# EAGLE design tractor_panel_1v0 (EAGLE 9.5.2)
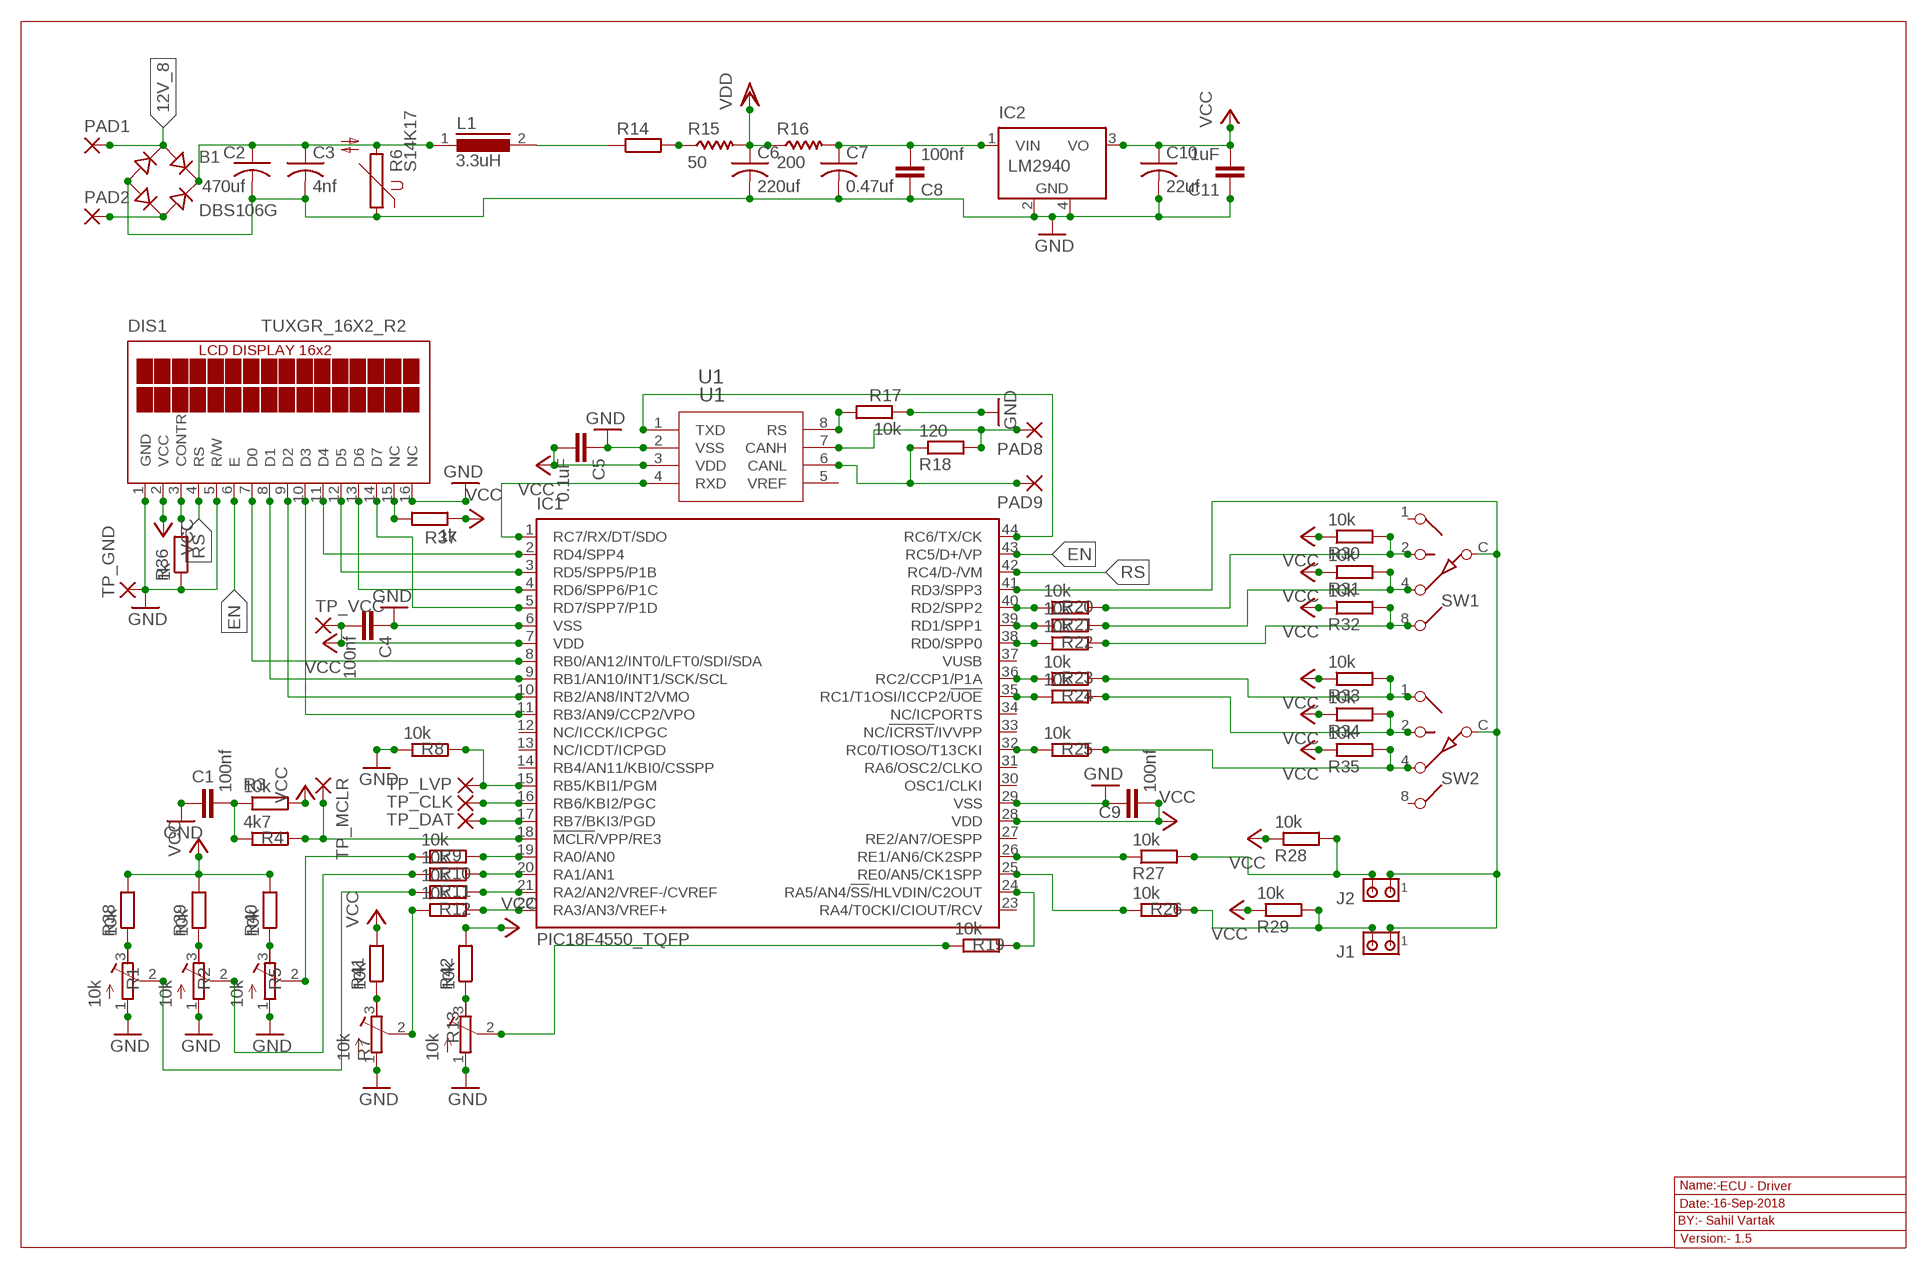
[diagram p0: schematic, sheet 1]

## Parts
B1  DBS106G  [DBS]
C1  100nf  CC0603  [C0603]
C2  470uf  C-US050-075X075  [C050-075X075]
C3  4nf  C-US050-045X075  [C050-045X075]
C4  100nf  CC0603  [C0603]
C5  0.1uF  CC0603  [C0603]
C6  220uf  C-US025-025X050  [C025-025X050]
C7  0.47uf  C-US025-025X050  [C025-025X050]
C8  100nf  CC0603  [C0603]
C9  100nf  CC0603  [C0603]
C10  22uf  C-US025-025X050  [C025-025X050]
C11  1uF  CC0603  [C0603]
DIS1  TUXGR_16X2_R2  [TUXGR_16X2_R2]
IC1  PIC18F4550_TQFP  [TQFP44]
IC2  LM2940  LM2936MP-3.0  [SOT223]
J1  MTA02-156  [1X2MTA]
J2  MTA02-156  [1X2MTA]
L1  3.3uH  82114R  [82114R]
PAD1  2,54/1,1  [2,54/1,1]
PAD2  2,54/1,1  [2,54/1,1]
PAD8  2,54/1,1  [2,54/1,1]
PAD9  2,54/1,1  [2,54/1,1]
R1  10k  R-TRIMM3296W  [RTRIM3296W]
R2  10k  R-TRIMM3296W  [RTRIM3296W]
R3  10k  RR0603  [R0603]
R4  4k7  RR0603  [R0603]
R5  10k  R-TRIMM3296W  [RTRIM3296W]
R6  S14K17  [S14K17]
R7  10k  R-TRIMM3296W  [RTRIM3296W]
R8  10k  RR0603  [R0603]
R9  10k  RR0603  [R0603]
R10  10k  RR0603  [R0603]
R11  10k  RR0603  [R0603]
R12  10k  RR0603  [R0603]
R13  10k  R-TRIMM3296W  [RTRIM3296W]
R14  R-EU_R0603  [R0603]
R15  50  R-US_WSC2515  [WSC2515]
R16  200  R-US_WSC2515  [WSC2515]
R17  10k  RR0603  [R0603]
R18  120  RR0603  [R0603]
R19  10k  RR0603  [R0603]
R20  10k  RR0603  [R0603]
R21  10k  RR0603  [R0603]
R22  10k  RR0603  [R0603]
R23  10k  RR0603  [R0603]
R24  10k  RR0603  [R0603]
R25  10k  RR0603  [R0603]
R26  10k  RR0603  [R0603]
R27  10k  RR0603  [R0603]
R28  10k  RR0603  [R0603]
R29  10k  RR0603  [R0603]
R30  10k  RR0603  [R0603]
R31  10k  RR0603  [R0603]
R32  10k  RR0603  [R0603]
R33  10k  RR0603  [R0603]
R34  10k  RR0603  [R0603]
R35  10k  RR0603  [R0603]
R36  1k  RR0603  [R0603]
R37  1k  RR0603  [R0603]
R38  10k  RR0603  [R0603]
R39  10k  RR0603  [R0603]
R40  10k  RR0603  [R0603]
R41  10k  RR0603  [R0603]
R42  10k  RR0603  [R0603]
SW1  SW-C10  [SW-C10]
SW2  SW-C10  [SW-C10]
TP_CLK  1,6/0,8  [1,6/0,8]
TP_DAT  1,6/0,8  [1,6/0,8]
TP_GND  1,6/0,8  [1,6/0,8]
TP_LVP  1,6/0,8  [1,6/0,8]
TP_MCLR  1,6/0,8  [1,6/0,8]
TP_VCC  1,6/0,8  [1,6/0,8]
U1  U1  MCP2551-I/SNSOIC8-N_MC-M  [SOIC8-N_MC-M]

## Nets
12V_8: B1.AC1 PAD1.1(P)
EN: DIS1.6(E) IC1.43(RC5/D+/VP)
GND: B1.- C1.1 C2.2 C3.2 C4.1 C5.1 C6.2 C7.2 C8.1 C9.1 C10.2 C11.1 DIS1.1(GND) DIS1.5(R/W) DIS1.16(NC) IC1.6(VSS) IC1.29(VSS) IC2.2(GND) IC2.4(GND) R1.1(A) R2.1(A) R5.1(A) R6.1 R7.1(A) R8.1 R13.1(A) R17.1 R36.1 TP_GND.1(P) U1.2(VSS)
N$1: B1.AC2 PAD2.1(P)
N$2: DIS1.7(D0) IC1.8(RB0/AN12/INT0/LFT0/SDI/SDA)
N$3: L1.2 R14.1
N$4: DIS1.8(D1) IC1.9(RB1/AN10/INT1/SCK/SCL)
N$5: R13.2(S) R19.1
N$6: DIS1.9(D2) IC1.10(RB2/AN8/INT2/VMO)
N$7: C7.1 C8.2 IC2.1(VIN) R16.2
N$8: DIS1.3(CONTR) R36.2
N$9: DIS1.15(NC) R37.2
N$10: DIS1.10(D3) IC1.11(RB3/AN9/CCP2/VPO)
N$11: DIS1.11(D4) IC1.2(RD4/SPP4)
N$12: DIS1.14(D7) IC1.5(RD7/SPP7/P1D)
N$13: R1.3(E) R38.1
N$14: R2.3(E) R39.1
N$15: R14.2 R15.1
N$16: R5.3(E) R40.1
N$17: R7.3(E) R41.1
N$18: R13.3(E) R42.1
N$19: IC1.41(RD3/SPP3) J1.1 J2.1 SW1.C SW2.C
N$27: B1.+ C2.1 C3.1 L1.1 R6.2
N$28: DIS1.13(D6) IC1.4(RD6/SPP6/P1C)
N$29: DIS1.12(D5) IC1.3(RD5/SPP5/P1B)
N$30: PAD9.1(P) R18.1 U1.6(CANL)
N$31: PAD8.1(P) R18.2 U1.7(CANH)
N$32: IC1.1(RC7/RX/DT/SDO) U1.4(RXD)
N$33: IC1.44(RC6/TX/CK) U1.1(TXD)
N$34: R17.2 U1.8(RS)
N$35: J2.2 R27.2 R28.2
N$36: IC1.26(RE1/AN6/CK2SPP) R27.1
N$37: IC1.32(RC0/TIOSO/T13CKI) R25.1
N$38: IC1.35(RC1/T1OSI/ICCP2/!UOE) R24.1
N$39: IC1.36(RC2/CCP1/P1A) R23.1
N$40: IC1.38(RD0/SPP0) R22.1
N$41: IC1.39(RD1/SPP1) R21.1
N$42: IC1.40(RD2/SPP2) R20.1
N$43: R20.2 R30.2 SW1.2
N$44: R21.2 R31.2 SW1.4
N$45: R22.2 R32.2 SW1.8
N$46: R23.2 R33.2 SW2.1
N$47: R24.2 R34.2 SW2.2
N$48: R25.2 R35.2 SW2.4
N$49: IC1.25(RE0/AN5/CK1SPP) R26.1
N$50: IC1.17(RB7/BKI3/PGD) TP_DAT.1(P)
N$51: IC1.16(RB6/KBI2/PGC) TP_CLK.1(P)
N$52: J1.2 R26.2 R29.2
N$53: IC1.22(RA3/AN3/VREF+) R12.2
N$54: IC1.21(RA2/AN2/VREF-/CVREF) R11.2
N$55: IC1.20(RA1/AN1) R10.2
N$56: IC1.19(RA0/AN0) R9.2
N$57: R5.2(S) R9.1
N$58: R2.2(S) R10.1
N$59: R1.2(S) R11.1
N$60: R7.2(S) R12.1
N$61: IC1.24(RA5/AN4/!SS!/HLVDIN/C2OUT) R19.2
N$62: C1.2 R3.1 R4.1
N$63: IC1.18(!MCLR!/VPP/RE3) R4.2 TP_MCLR.1(P)
N$64: IC1.15(RB5/KBI1/PGM) R8.2 TP_LVP.1(P)
RS: DIS1.4(RS) IC1.42(RC4/D-/VM)
VCC: C4.2 C5.2 C9.2 C10.1 C11.2 DIS1.2(VCC) IC1.7(VDD) IC1.28(VDD) IC2.3(VO) R3.2 R28.1 R29.1 R30.1 R31.1 R32.1 R33.1 R34.1 R35.1 R37.1 R38.2 R39.2 R40.2 R41.2 R42.2 TP_VCC.1(P) U1.3(VDD)
VDD: C6.1 R15.2 R16.1
Unconnected: IC1.12(NC/ICCK/ICPGC) IC1.13(NC/ICDT/ICPGD) IC1.14(RB4/AN11/KBI0/CSSPP) IC1.23(RA4/T0CKI/CIOUT/RCV) IC1.27(RE2/AN7/OESPP) IC1.30(OSC1/CLKI) IC1.31(RA6/OSC2/CLKO) IC1.33(NC/!ICRST!/IVVPP) IC1.34(NC/ICPORTS) IC1.37(VUSB) SW1.1 SW2.8 U1.5(VREF)

## Notes on the sheet
- Name:- | ECU - Driver
- Date:- | 16-Sep-2018
- BY:- Sahil Vartak
- Version:- 1.5

## Library data of the parts
B1 = rectifier:DB?*G: Single Phase 1.0 AMP Glass Passivated Bridge Rectifier Taiwan Semiconductor Co.,Ltd. - TSC Source: http://www.taiwansemi.com/TSCbig5/ezcatfiles/cust/img/img/db101g.pdf http://www.ts.com.tw/db/pictures/modules/PDT/PDT060207001/DBLS201G.pdf
C1 C4 C5 C8 C9 C11 = eagle-ltspice:C: CAPACITOR, European symbol; SPICEMODEL: NONE; SPICEPREFIX: C
C2 = resistor:C-US: CAPACITOR, American symbol
C3 C6 C7 C10 = rcl:C-US: CAPACITOR, American symbol
DIS1 = display-lcd:TUXGR_16X2_R2: Tuxgraphics LCD display 16x2 characters reflective, without background light Source: tuxgr_12x2_r2.pdf; OC_FARNELL: unknown; OC_NEWARK: unknown
IC1 = microchip:PIC18F4*_TQFP: USB Microcontrollers with nanoWatt Technology High-Performance, Enhanced Flash, 28/40/44-Pin, Source: http://ww1.microchip.com/downloads/en/devicedoc/39632c.pdf; MF: MICROCHIP; MPN: PIC18F4550-I/PT; OC_FARNELL: 9321365; OC_NEWARK: 08J9633
IC2 = national-semiconductor:LM2936MP?*: Ultra-Low Quiescent Current LDO Voltage Regulator Source: Data sheet <http://www.national.com/ds/LM/LM2936.pdf>; MF: NATIONAL SEMICONDUCTOR; MPN: LM2936MP-3.0/NOPB; OC_FARNELL: 1496125; OC_NEWARK: 41K4522
J1 J2 = con-amp:MTA02-156: AMP connector
L1 = inductors:82114R: INDUCTOR; SPICEPREFIX: L
PAD1 PAD2 PAD8 PAD9 = wirepad:2,54/1,1: THROUGH-HOLE PAD
R1 R2 R5 R7 R13 = rcl:R-TRIMM: Trimm resistor; SPICEMODEL: X; SPICEPREFIXL: POT
R3 R4 R8-R12 R17-R42 = eagle-ltspice:R: RESISTOR, European symbol; SPICEMODEL: NONE; SPICEPREFIX: R
R6 = varistor:S14K17: VARISTOR
R14 = resistor:R-EU_: RESISTOR, European symbol
R15 R16 = resistor:R-US_: RESISTOR, American symbol
SW1 SW2 = special:SW-C10: SWITCH 10-step rotary switch
TP_CLK TP_DAT TP_GND TP_LVP TP_MCLR TP_VCC = wirepad:1,6/0,8: THROUGH-HOLE PAD
U1 = mcp2551:MCP2551-I/SN; BUILT_BY: EMA_UL_Team; MANUFACTURER_PART_NUMBER: MCP2551-I/SN; VENDOR: Microchip

## Board
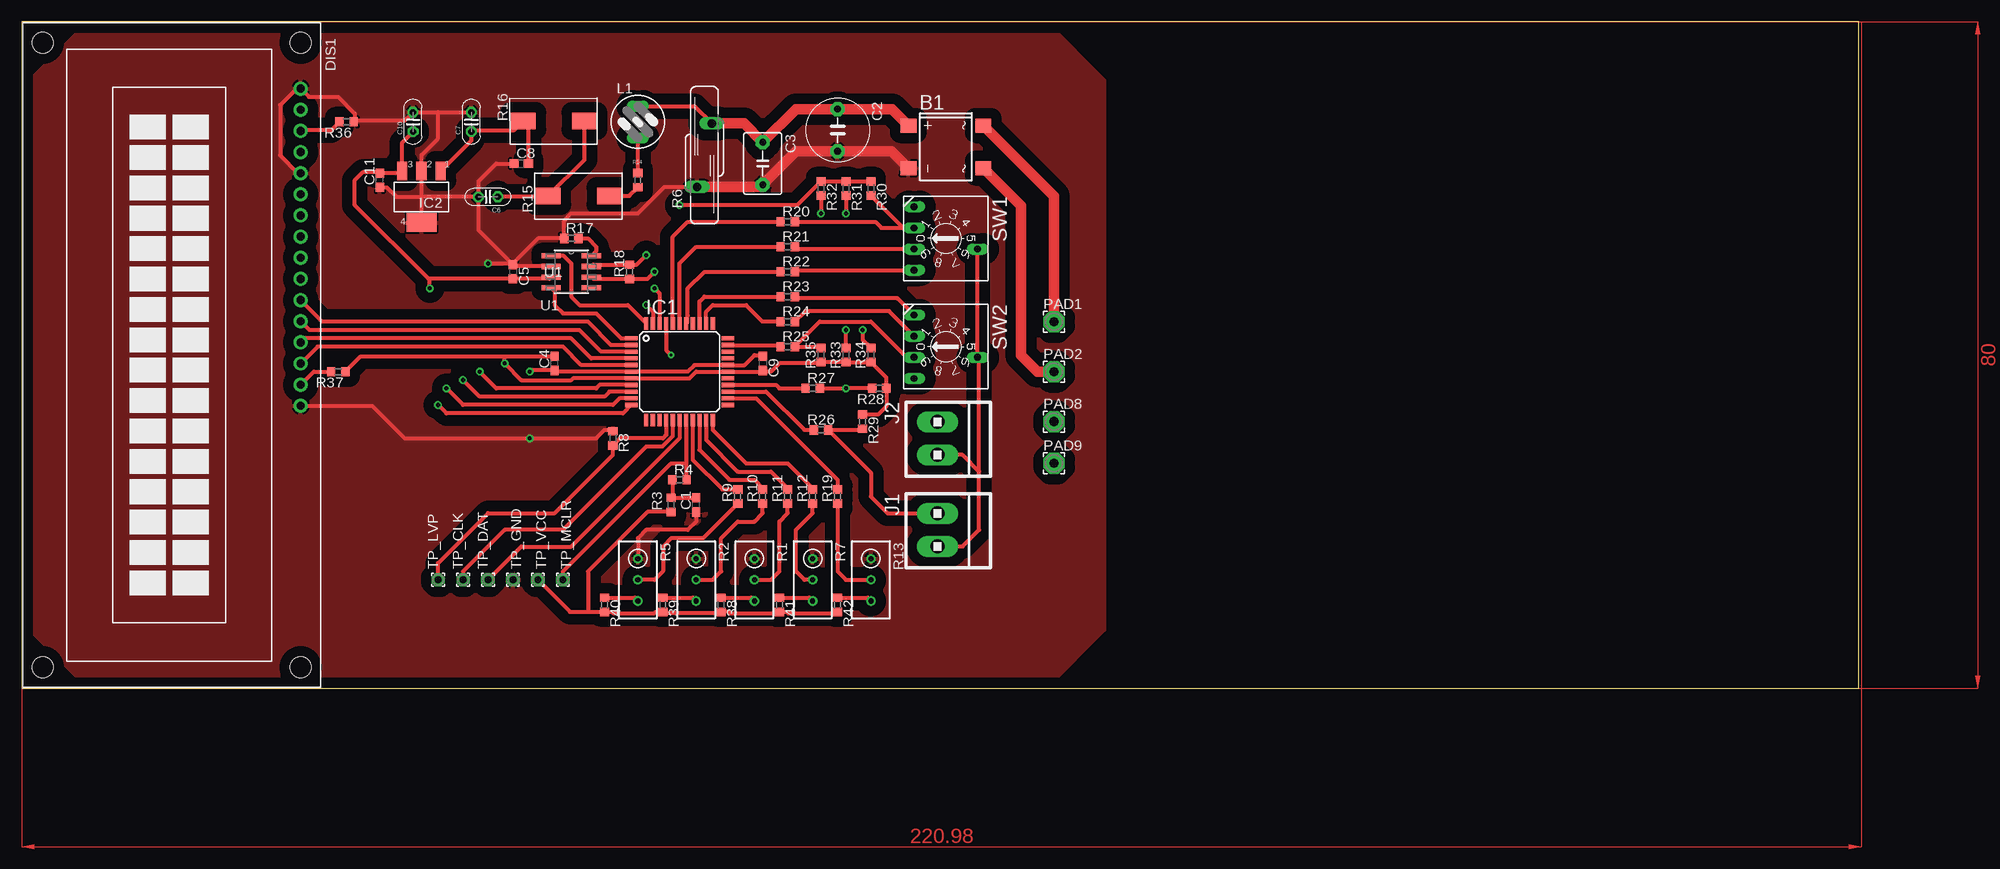
[diagram p1: board, top side]
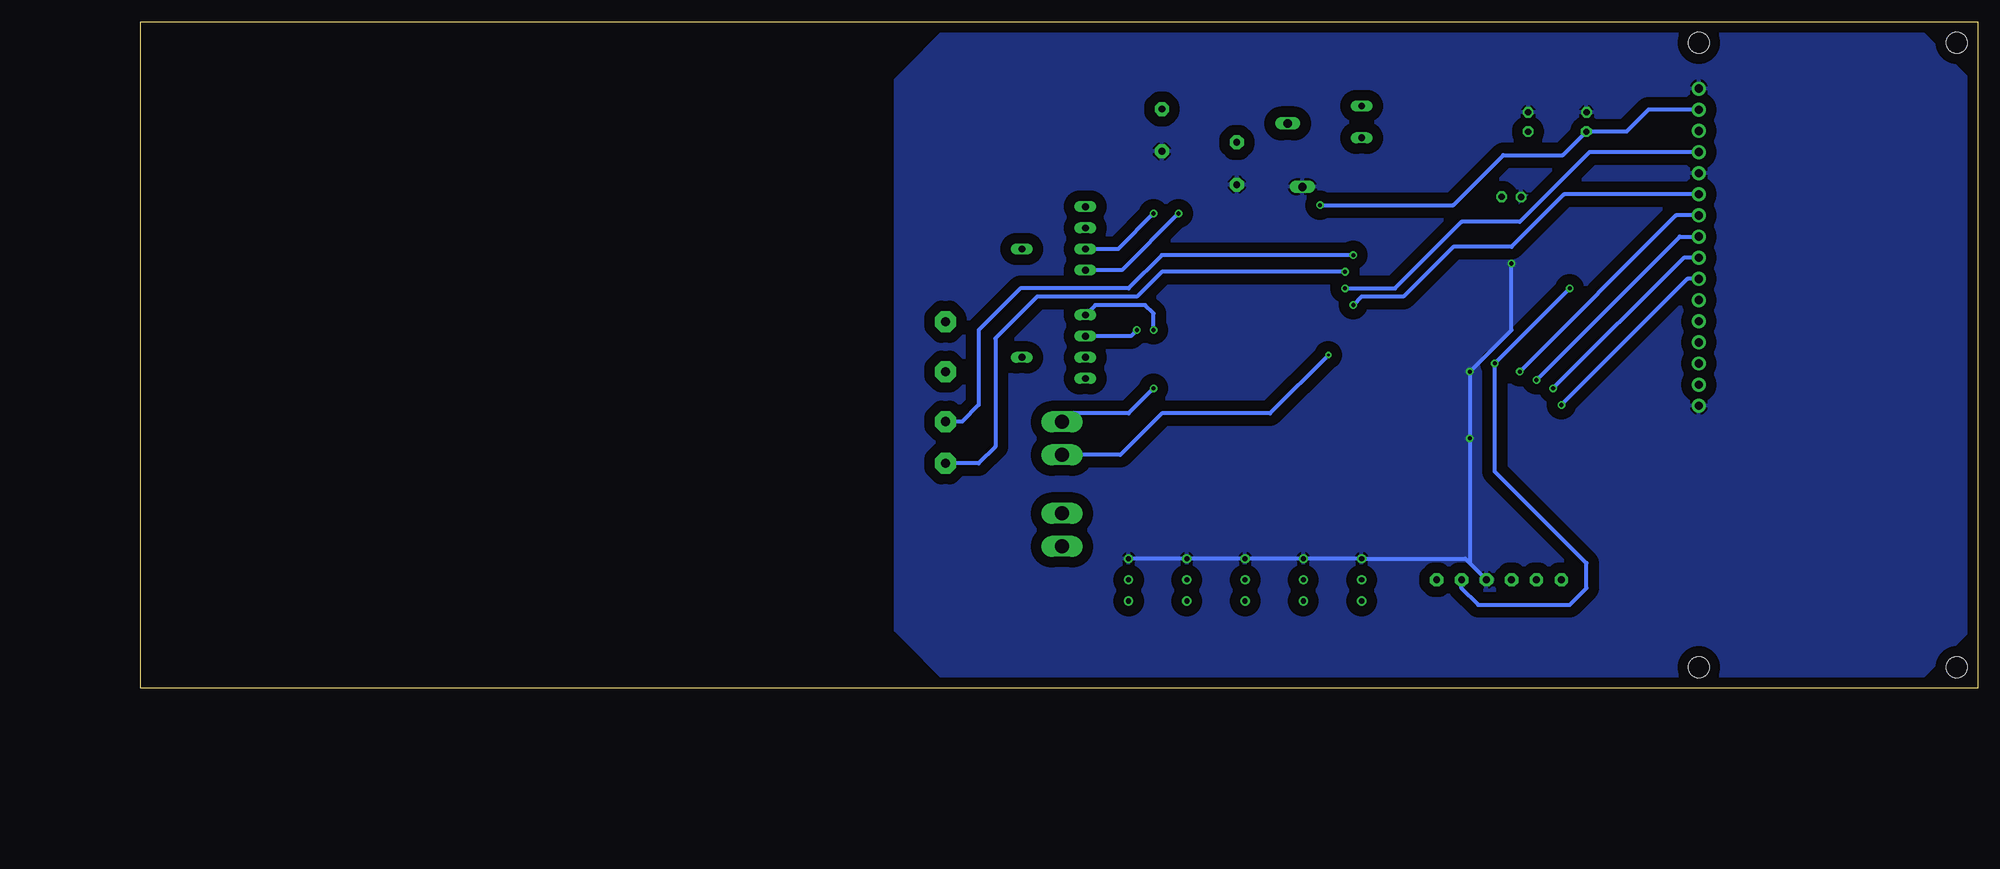
[diagram p2: board, bottom side, seen from below]

Size 220.65 x 80 mm. Coordinates in mm from the lower left corner, seen from the top.
Outline: 0,0 220.65,0 220.65,80 0,80 0,0
Copper layers (1*16): Top 0.035mm / dielectric 1.5mm / Bottom 0.035mm
Design rules "default": minimum track width 6mil, minimum drill 0.35mm, track to track 6mil, track to pad 6mil, pad to pad 6mil, via to via 6mil, smd to smd 6mil, copper to edge 40mil, drill to drill 6mil, minimum pad ring 10mil, minimum via ring 8mil, stop-mask expansion 4mil, vias tented up to drill 0mil, thermal gap 10mil

### Footprints (pad centres in the part's own frame; a part is rotated, then mirrored left to right if it is on the bottom)
DBS = smd 1.7 x 1.9: + -2.55,-4.5; - 2.55,-4.5; AC1 -2.55,4.5; AC2 2.55,4.5
C0603 = smd 1.1 x 1: 1 -0.85,0; 2 0.85,0
C050-075X075 = drill 0.813 pad 1.676 octagon: 1 -2.54,0; 2 2.54,0
C050-045X075 = drill 0.813 pad 1.676 octagon: 1 -2.54,0; 2 2.54,0
C025-025X050 = drill 0.762 pad 1.27 octagon: 1 -1.176,-0.006; 2 1.159,0.007
TUXGR_16X2_R2 = drill 1 pad 1.676: 1 -32,15.5; 2 -29.46,15.5; 3 -26.92,15.5; 4 -24.38,15.5; 5 -21.84,15.5; 6 -19.3,15.5; 7 -16.76,15.5; 8 -14.22,15.5; 9 -11.68,15.5; 10 -9.14,15.5; 11 -6.6,15.5; 12 -4.06,15.5; 13 -1.52,15.5; 14 1.02,15.5; 15 3.56,15.5; 16 6.1,15.5 | hole 2.5: -37.5,-15.5; 37.5,-15.5; -37.5,15.5; 37.5,15.5
TQFP44 = smd 1.5 x 0.5: 1 -5.8,4; 2 -5.8,3.2; 3 -5.8,2.4; 4 -5.8,1.6; 5 -5.8,0.8; 6 -5.8,0; 7 -5.8,-0.8; 8 -5.8,-1.6; 9 -5.8,-2.4; 10 -5.8,-3.2; 11 -5.8,-4; 23 5.8,-4; 24 5.8,-3.2; 25 5.8,-2.4; 26 5.8,-1.6; 27 5.8,-0.8; 28 5.8,0; 29 5.8,0.8; 30 5.8,1.6; 31 5.8,2.4; 32 5.8,3.2; 33 5.8,4 | smd 0.5 x 1.5: 12 -4,-5.8; 13 -3.2,-5.8; 14 -2.4,-5.8; 15 -1.6,-5.8; 16 -0.8,-5.8; 17 0,-5.8; 18 0.8,-5.8; 19 1.6,-5.8; 20 2.4,-5.8; 21 3.2,-5.8; 22 4,-5.8; 34 4,5.8; 35 3.2,5.8; 36 2.4,5.8; 37 1.6,5.8; 38 0.8,5.8; 39 0,5.8; 40 -0.8,5.8; 41 -1.6,5.8; 42 -2.4,5.8; 43 -3.2,5.8; 44 -4,5.8
SOT223 = smd 1.219 x 2.235: 1 -2.311,-3.099; 2 0,-3.099; 3 2.311,-3.099 | smd 3.6 x 2.2: 4 0,3.099
1X2MTA = drill 1.676 long: 1 1.981,0; 2 -1.981,0
82114R = drill 0.813 long: 1 0,1.905; 2 0,-1.905
2,54/1,1 = drill 1.118 pad 2.54 octagon: 1 0,0
RTRIM3296W = drill 0.61: 1 0,-2.54; 2 0,0; 3 0,2.54
R0603 = smd 1 x 1.1: 1 -0.85,0; 2 0.85,0
S14K17 = drill 1.016 long: 1 -0.889,-3.81; 2 0.889,3.81
WSC2515 = smd 3 x 2: 1 -3.575,-0.1; 2 3.775,-0.1
SW-C10 = drill 0.813 long: 1 -3.81,-3.81; 2 -1.27,-3.81; 4 1.27,-3.81; 8 3.81,-3.81; C 1.27,3.81
1,6/0,8 = drill 0.813 pad 1.6 octagon: 1 0,0
SOIC8-N_MC-M = smd 2.286 x 0.61: 1 -2.413,1.905; 2 -2.413,0.635; 3 -2.413,-0.635; 4 -2.413,-1.905; 5 2.413,-1.905; 6 2.413,-0.635; 7 2.413,0.635; 8 2.413,1.905

### Placement (x,y rotation side)
B1  111,65 270 top
C1  81,22 90 top
C2  98,67 270 top
C3  89,63 270 top
C4  64,39 90 top
C5  59,50 270 top
C6  56,59 180 top
C7  54,68 90 top
C8  60,63 0 top
C9  89,39 270 top
C10  47,68 90 top
C11  43,61 90 top
DIS1  18,40 270 top
IC1  79,38 0 top
IC2  48,59 180 top
J1  110,19 270 top
J2  110,30 270 top
L1  74,68 0 top
PAD1  124,44 0 top
PAD2  124,38 0 top
PAD8  124,32 0 top
PAD9  124,27 0 top
R1  88,13 180 top
R2  81,13 180 top
R3  78,22 270 top
R4  79,25 0 top
R5  74,13 180 top
R6  82,64 0 top
R7  95,13 180 top
R8  71,30 270 top
R9  86,23 90 top
R10  89,23 90 top
R11  92,23 90 top
R12  95,23 90 top
R13  102,13 180 top
R14  74,61 270 top
R15  67,59 180 top
R16  64,68 180 top
R17  66,54 0 top
R18  73,50 90 top
R19  98,23 90 top
R20  92,56 0 top
R21  92,53 0 top
R22  92,50 0 top
R23  92,47 0 top
R24  92,44 0 top
R25  92,41 0 top
R26  96,31 0 top
R27  95,36 0 top
R28  103,36 180 top
R29  101,32 270 top
R30  102,60 270 top
R31  99,60 270 top
R32  96,60 270 top
R33  99,40 90 top
R34  102,40 90 top
R35  96,40 90 top
R36  39,68 180 top
R37  38,38 180 top
R38  84,10 270 top
R39  77,10 270 top
R40  70,10 270 top
R41  91,10 270 top
R42  98,10 270 top
SW1  111,54 270 top
SW2  111,41 270 top
TP_CLK  53,13 90 top
TP_DAT  56,13 90 top
TP_GND  59,13 0 top
TP_LVP  50,13 90 top
TP_MCLR  65,13 0 top
TP_VCC  62,13 0 top
U1  66,50 0 top

### Tracks (layer width: path | path; a pad name or v marks a point on that pad's centre or on a via)
12V_8
  Top 1.27: B1.AC1 124,59.05 PAD1.1
EN  (via drill 0.5)
  Top 0.508: v75,46 75.8,45.2 IC1.43
  Bottom 0.508: DIS1.6 49.7,59.3 56,53 63,53 69,47 74,47 v75,46
GND  (via drill 0.5)
  Top 0.508: U1.2 59.22,50.63 C5.1 | C5.1 59,51 62,54 R17.1 65.15,56.15 66,57 74,57 77.19,60.19 R6.1 | 50,69.16 C10.2 45.98,68.15 40,68.15 | 50,69.16 C7.2 | IC2.4 48,59 | 48,59 IC2.2 48,64 50,66 50,69.16 | C9.1 88.85,40 88,40 86.8,38.8 IC1.29 80.8,38.8 80,38 IC1.6 64.15,38 C4.1 61.15,38.15 v61,38 | 40,68.15 R36.1 | DIS1.5 33.16,61.84 31,64 31,70 33,72 DIS1.1 34.5,71 38,71 40,69 40,68.15 | C5.1 54.84,55.01 C6.2 | C6.2 54.84,60.84 57,63 C8.1 | C11.1 43.85,60.15 45,59 48,59 | 48,59 48.01,58.99 C6.2 | C1.1 81,20 80,19 75,19 74,18 R5.1 | DIS1.16 42.1,33.9 46,30 v61,30 69,30 70,31 70.85,31 R8.1 | v56,51 58.85,51 C5.1
  Top 1.27: B1.- 104.5,64.45 96.01,64.45 | 96.01,64.45 96.02,64.46 C2.2 | R6.1 88.73,60.19 C3.2 92.99,64.45 96.01,64.45
  Bottom 0.508: R13.1 R7.1 R1.1 R2.1 R5.1 61.54,15.54 TP_GND.1 61,15 v61,30 v61,38 56,43 v56,51
  pour Top (isolate 1.27): 0,72 8,80 123,80 130,73 130,7 123,0 8,0 0,8
  pour Bottom (isolate 1.27): 8,80 123,80 130,73 130,7 123,0 8,0 0,8 0,72
N$1
  Top 1.27: B1.AC2 120,57.95 120,40 122,38 PAD2.1
N$2  (via drill 0.5)
  Top 0.508: IC1.8 69.4,36.4 69,36 57,36 v55,38
  Bottom 0.508: DIS1.7 36.24,56.76 v55,38
N$3
  Top 0.508: R14.1 L1.2
N$4  (via drill 0.5)
  Top 0.508: IC1.9 70.6,35.6 70,35 55,35 v53,37
  Bottom 0.508: DIS1.8 35.78,54.22 v53,37
N$5
  Top 0.508: R19.1 98,14 99,13 R13.2
N$6  (via drill 0.5)
  Top 0.508: IC1.10 71.8,34.8 71,34 53,34 v51,36
  Bottom 0.508: DIS1.9 35.32,51.68 v51,36
N$7
  Top 0.508: IC2.1 54.01,65.79 C7.1 54.18,67 59.12,67 60.06,67.94 | 60.06,67.94 R16.2 | C8.2 60.85,67.15 60.06,67.94
N$8
  Top 0.508: DIS1.3 33.58,67 37.15,67 R36.2
N$9
  Top 0.508: DIS1.15 35.06,38 R37.2
N$10  (via drill 0.5)
  Top 0.508: IC1.11 72.2,33 51,33 v50,34
  Bottom 0.508: DIS1.10 34.86,49.14 v50,34
N$11
  Top 0.508: IC1.2 70.8,41.2 68,44 36.1,44 DIS1.11
N$12
  Top 0.508: IC1.5 67.2,38.8 65,41 35.52,41 DIS1.14
N$13
  Top 0.508: R38.1 87.61,10.85 R1.3
N$14
  Top 0.508: R39.1 80.61,10.85 R2.3
N$15
  Top 0.508: R15.1 72.95,59.1 R14.2
N$16
  Top 0.508: R40.1 73.61,10.85 R5.3
N$17
  Top 0.508: R41.1 94.61,10.85 R7.3
N$18
  Top 0.508: R42.1 101.61,10.85 R13.3
N$19  (via drill 0.35)
  Top 0.508: J1.1 113.02,17.02 115,19 115,26 | J2.1 112.98,28.02 115,26 | 115,26 115,39.54 SW2.C SW1.C | IC1.41 77.4,40.6 v78,40
  Bottom 0.508: v78,40 85,33 98,33 103,28 109.98,28 J2.1
N$27
  Top 0.508: L1.1 80.79,69.91 R6.2
  Top 1.27: B1.+ 104.51,69.54 C2.1 93,69.54 C3.1 86.73,67.81 R6.2
N$28
  Top 0.508: IC1.4 68.4,39.6 66,42 33.98,42 DIS1.13
N$29
  Top 0.508: IC1.3 69.6,40.4 67,43 34.56,43 DIS1.12
N$30  (via drill 0.5)
  Top 0.508: U1.6 68.63,49.15 R18.1 75.15,49.15 v76,50
  Bottom 0.508: v76,50 98,50 101,47 113,47 118,42 118,29 120,27 PAD9.1
N$31  (via drill 0.5)
  Top 0.508: U1.7 68.63,50.85 R18.2 73.85,50.85 v75,52
  Bottom 0.508: v75,52 98,52 102,48 115,48 120,43 120,34 122,32 PAD8.1
N$32
  Top 0.508: U1.4 64,47.68 64,46 65,45 69,45 72,42 IC1.1
N$33
  Top 0.508: U1.1 65.09,51.91 66,51 66,47 67,46 72.8,46 IC1.44
N$34
  Top 0.508: R17.2 68,54 69,53 69,52.49 U1.8
N$35  (via drill 0.5)
  Top 0.508: R27.2 v99,36 R28.2
  Bottom 0.508: v99,36 102,33 108.98,33 J2.2
N$36
  Top 0.508: IC1.26 90.6,36.4 91,36 R27.1
N$37
  Top 0.508: IC1.32 90.95,41.2 R25.1
N$38
  Top 0.508: R24.1 89,44 87,46 83,46 82.2,45.2 IC1.35
N$39
  Top 0.508: IC1.36 81.4,46.4 82,47 R23.1
N$40
  Top 0.508: IC1.38 79.94,43.94 79.94,44.72 80,44.77 80,48 82,50 R22.1
N$41
  Top 0.508: IC1.39 79,51 81,53 R21.1
N$42
  Top 0.508: IC1.40 78.2,54.2 80,56 R20.1
N$43
  Top 0.508: R20.2 102.54,56 103.27,55.27 SW1.2 105.88,55.27 R30.2
N$44  (via drill 0.5)
  Top 0.508: R21.2 93.12,52.73 SW1.4 | R31.2 v99,57
  Bottom 0.508: v99,57 103.27,52.73 SW1.4
N$45  (via drill 0.5)
  Top 0.508: R22.2 93.04,50.19 SW1.8 | R32.2 v96,57
  Bottom 0.508: v96,57 102.81,50.19 SW1.8
N$46  (via drill 0.5)
  Top 0.508: R23.2 93.04,46.81 105.19,46.81 SW2.1 | R33.2 v99,43
  Bottom 0.508: v99,43 99,45 100,46 106,46 SW2.1
N$47  (via drill 0.5)
  Top 0.508: SW2.2 104.19,45.27 94.12,45.27 R24.2 | v101,43 101,41.85 R34.2
  Bottom 0.508: v101,43 101.73,42.27 SW2.2
N$48
  Top 0.508: R35.2 95.85,41 R25.2 95.85,44 102,44 106.27,39.73 SW2.4
N$49
  Top 0.508: IC1.25 89.4,35.6 94,31 R26.1
N$50
  Top 0.508: IC1.17 79,30 66,17 60,17 TP_DAT.1
N$51
  Top 0.508: TP_CLK.1 53,14 58,19 65,19 75,29 76.93,29 78.2,30.27 IC1.16
N$52
  Top 0.508: J1.2 104.02,20.98 102,23 102,25.85 R26.2 100.85,31 R29.2
N$53
  Top 0.508: IC1.22 83,31 87,27 92,27 95,24 R12.2
N$54
  Top 0.508: IC1.21 82.2,29.8 86,26 90,26 92,24 R11.2
N$55
  Top 0.508: IC1.20 81.4,28.6 85,25 88,25 89,24 R10.2
N$56
  Top 0.508: IC1.19 80.6,27.4 84.15,23.85 R9.2
N$57
  Top 0.508: R9.1 81.85,18 78,18 77,17 77,14 76,13 R5.2
N$58
  Top 0.508: R2.2 83,13 84,14 84,18 86,20 88,20 89,21 R10.1
N$59
  Top 0.508: R1.2 90,13 91,14 91,20 92,21 R11.1
N$60
  Top 0.508: R7.2 94,13 93,14 93,19 95,21 R12.1
N$61
  Top 0.508: IC1.24 88.2,34.8 98,25 R19.2
N$62
  Top 0.508: R4.1 78.15,23 R3.1 C1.2
N$63
  Top 0.508: IC1.18 79.8,27 | 79.8,27 79.8,25.05 R4.2 | 79.8,27 78,27 65,14 TP_MCLR.1
N$64
  Top 0.508: IC1.15 77.4,30.4 77,30 71.85,30 R8.2 71,28 64,21 56,21 50,15 TP_LVP.1
RS  (via drill 0.5)
  Top 0.508: v76,48 76.6,47.4 IC1.42
  Bottom 0.508: DIS1.4 46.62,64.38 55,56 62,56 70,48 v76,48
VCC  (via drill 0.5)
  Top 0.508: R30.1 R31.1 R32.1 93.15,58 v79,58 | U1.3 63.37,49.15 C5.2 49,49.15 | 88.85,38 C9.2 | 88.85,38 IC1.28 81,38 80.2,37.2 IC1.7 66.2,37.2 66,37 60,37 v58,39 58,39.85 | 88.85,38 90,38 91,39 95.85,39 R35.1 R33.1 R34.1 103.85,37.3 R28.1 103.85,33.85 102.85,32.85 R29.1 | C10.1 45.69,65.51 IC2.3 45.44,61.85 C11.2 42.85,62 41,62 40,61 40,58 48.85,49.15 49,49.15 | R3.2 75.15,21.15 68,14 68,9.15 | R37.1 40.7,39.85 58,39.85 | v49,48 49,49.15 | 58,39.85 C4.2 | TP_VCC.1 65.85,9.15 68,9.15 | 68,9.15 R40.2 70.85,9.15 71,9 76,9 76.15,9.15 R39.2 77.15,9 83.85,9 R38.2 84.85,9.15 85,9 90.85,9 R41.2 91.85,9.15 92,9 97.85,9 R42.2
  Bottom 0.508: DIS1.2 39.54,69.46 42.18,66.82 C10.1 49.83,64 57,64 63,58 v79,58 | v49,48 v58,39 58,26 47,15 47,12 49,10 60,10 62,12 TP_VCC.1
VDD
  Top 0.508: R16.1 67.58,63.45 R15.2 63.13,59.01 C6.1
(copper drawn outside any net)
  shapes: Top area x2